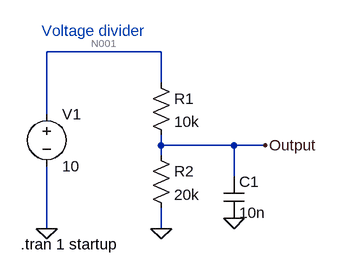
[diagram p0: schematic Tutorial1 - Voltage Divider.asc]
Tutorial1 - Voltage Divider.asc, the LTspice schematic file:
Version 4.1
SHEET 1 880 680
WIRE 224 48 48 48
WIRE 224 96 224 48
WIRE 48 144 48 48
WIRE 224 192 224 176
WIRE 336 192 224 192
WIRE 384 192 336 192
WIRE 224 208 224 192
WIRE 336 240 336 192
WIRE 48 320 48 224
WIRE 224 320 224 288
FLAG 48 320 0
FLAG 224 320 0
FLAG 384 192 Output
FLAG 336 304 0
SYMBOL res 208 80 R0
SYMATTR InstName R1
SYMATTR Value 10k
SYMBOL res 208 192 R0
SYMATTR InstName R2
SYMATTR Value 20k
SYMBOL voltage 48 128 R0
WINDOW 123 0 0 Left 0
WINDOW 39 0 0 Left 0
SYMATTR InstName V1
SYMATTR Value 10
SYMBOL cap 320 240 R0
SYMATTR InstName C1
SYMATTR Value 10n
TEXT 40 16 Left 2 ;Voltage divider
TEXT 8 344 Left 2 !.tran 1 startup

The netlist it stands for:
* Tutorial1 - Voltage Divider.asc
R1 N001 Output 10k
R2 Output 0 20k
V1 N001 0 10
C1 Output 0 10n
* Voltage divider
.tran 1 startup
.backanno
.end

* Results of the author's LTspice run, read from the files saved beside the schematic
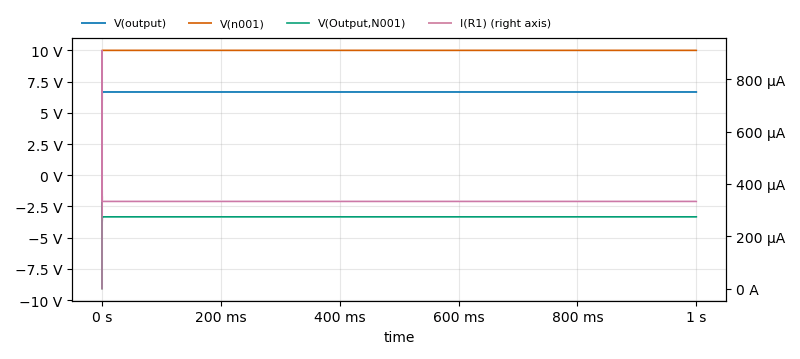
[diagram p1: Transient Analysis of Tutorial1 - Voltage Divider.asc, plotted from the saved traces]
* Transient Analysis, 1 run:
*   V(output): min 0 V, max 6.667 V, average 6.666 V, rms 6.666 V, last 6.667 V
*   V(n001): min 0 V, max 10 V, average 10 V, rms 10 V, last 10 V
*   V(Output,N001): min -9.096 V, max 0 V, average -3.334 V, rms 3.334 V, last -3.333 V
*   I(R1): min 0 A, max 909.6 µA, average 333.4 µA, rms 333.4 µA, last 333.3 µA